# Altium schematic sheet Nucleo_H743ZI_based_device.SchDoc: {Наименование}
size 420 x 297 mm; DocumentNumber: НРДЦ.ХХХХХХ.ХХХ ХХ; SheetNumber: 2; SheetTotal: 8; PageSetup: Record=PageOptions|CenterHorizontal=False|CenterVertical=False|PrintScale=0.95|XCorrection=0.00|YCorrection=0.00|PrintKind=1|BorderSize=5000000|LeftOffset=0|BottomOffset=0|Orientation=1|PaperLength=1000|PaperWidth=1000|Scale=100|PaperSource=15|PrintQuality=600|MediaType=1|DitherType=10|PaperKind=A4|PrintScaleMode=1; Rule: PcbType=ProtelPcb
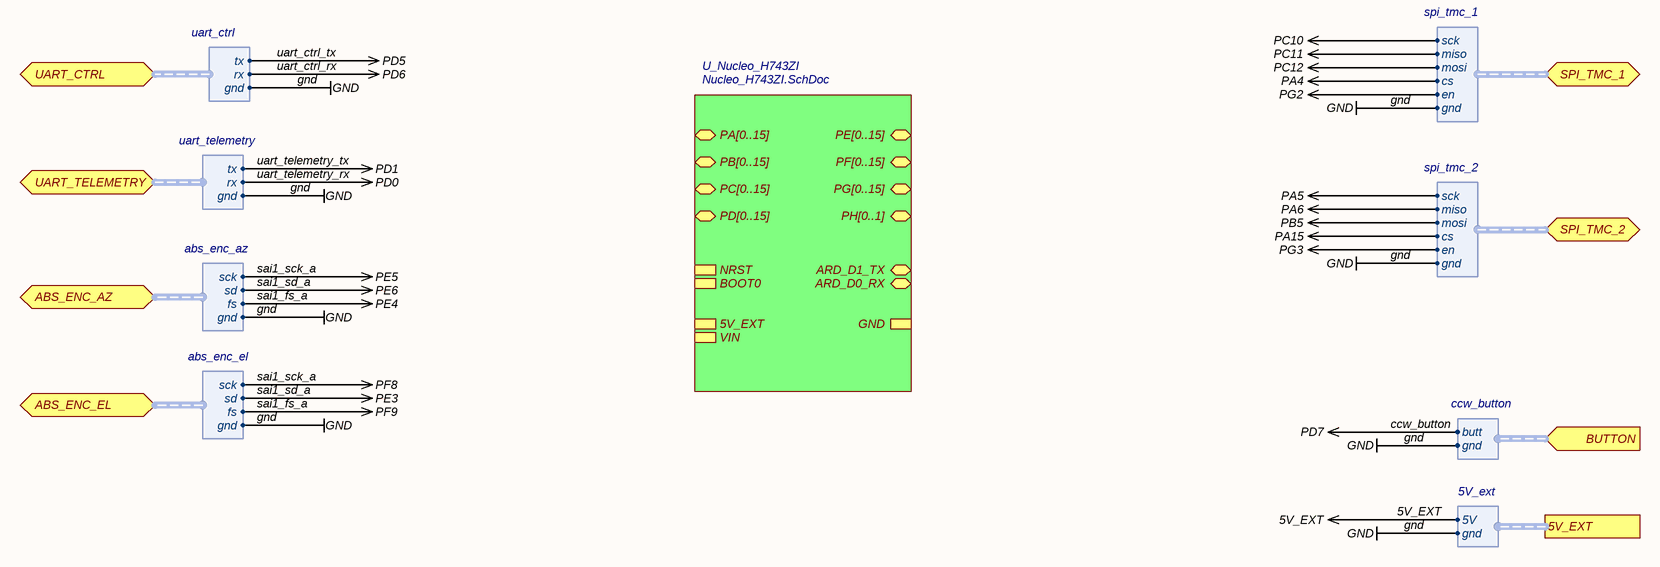
[diagram p0: Nucleo_H743ZI_based_device.SchDoc]

## Sub-sheets
U_Nucleo_H743ZI = Nucleo_H743ZI.SchDoc: PF[0..15] (bidir), PG[0..15] (bidir), PE[0..15] (bidir), PD[0..15] (bidir), ARD_D1_TX (bidir), PH[0..1] (bidir), PA[0..15] (bidir), ARD_D0_RX (bidir), BOOT0, PB[0..15] (bidir), PC[0..15] (bidir), NRST, 5V_EXT, VIN, GND

## Ports
5V_EXT (harness 5V_ext), ABS_ENC_AZ (bidir, harness abs_enc_az), ABS_ENC_EL (bidir, harness abs_enc_el), BUTTON (in, harness ccw_button), SPI_TMC_1 (bidir, harness spi_tmc_1), SPI_TMC_2 (bidir, harness spi_tmc_2), UART_CTRL (bidir, harness uart_ctrl), UART_TELEMETRY (bidir, harness uart_telemetry)

## Harnesses
abs_enc_az: sck, sd, fs, gnd
uart_ctrl: tx, rx, gnd
uart_telemetry: tx, rx, gnd
abs_enc_el: sck, sd, fs, gnd
ccw_button: butt, gnd
5V_ext: 5V, gnd
spi_tmc_1: sck, miso, gnd, mosi, en, cs
spi_tmc_2: sck, miso, gnd, mosi, en, cs

## Nets
5V_EXT: port 5V_EXT.5V
ccw_button: port BUTTON.butt  [also labelled PD7]
gnd: port ABS_ENC_AZ.gnd, port UART_CTRL.gnd, port UART_TELEMETRY.gnd, port ABS_ENC_EL.gnd, port BUTTON.gnd, port 5V_EXT.gnd, port SPI_TMC_1.gnd, port SPI_TMC_2.gnd
PA4: port SPI_TMC_1.cs
PA5: port SPI_TMC_2.sck
PA6: port SPI_TMC_2.miso
PA15: port SPI_TMC_2.cs
PB5: port SPI_TMC_2.mosi
PC10: port SPI_TMC_1.sck
PC11: port SPI_TMC_1.miso
PC12: port SPI_TMC_1.mosi
PG2: port SPI_TMC_1.en
PG3: port SPI_TMC_2.en
sai1_fs_a: port ABS_ENC_AZ.fs, port ABS_ENC_EL.fs  [also labelled PE4, PF9]
sai1_sck_a: port ABS_ENC_AZ.sck, port ABS_ENC_EL.sck  [also labelled PE5, PF8]
sai1_sd_a: port ABS_ENC_AZ.sd, port ABS_ENC_EL.sd  [also labelled PE3, PE6]
uart_ctrl_rx: port UART_CTRL.rx  [also labelled PD6]
uart_ctrl_tx: port UART_CTRL.tx  [also labelled PD5]
uart_telemetry_rx: port UART_TELEMETRY.rx  [also labelled PD0]
uart_telemetry_tx: port UART_TELEMETRY.tx  [also labelled PD1]

## Notes on the sheet
- Подп. и дата
- Инв. № дубл.
- Взам. инв. №
- Инв. № подл.
- Лист
- Изм.
- № докум.
- Подп.
- Дата
- Копировал
- Формат А3